# Altium schematic sheet TestPoints.SchDoc
size A
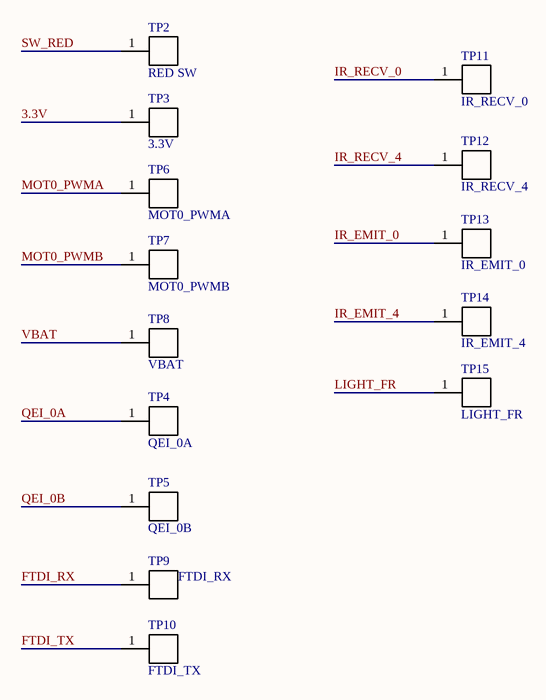
[diagram p0: TestPoints.SchDoc]

## Parts
TP2  RED SW  [TestPoint]
TP3  3.3V  [TestPoint]
TP4  QEI_0A  [TestPoint]
TP5  QEI_0B  [TestPoint]
TP6  MOT0_PWMA  [TestPoint]
TP7  MOT0_PWMB  [TestPoint]
TP8  VBAT  [TestPoint]
TP9  FTDI_RX  [TestPoint]
TP10  FTDI_TX  [TestPoint]
TP11  IR_RECV_0  [TestPoint]
TP12  IR_RECV_4  [TestPoint]
TP13  IR_EMIT_0  [TestPoint]
TP14  IR_EMIT_4  [TestPoint]
TP15  LIGHT_FR  [TestPoint]

## Nets
3.3V: TP3.1
FTDI_RX: TP9.1
FTDI_TX: TP10.1
IR_EMIT_0: TP13.1
IR_EMIT_4: TP14.1
IR_RECV_0: TP11.1
IR_RECV_4: TP12.1
LIGHT_FR: TP15.1
MOT0_PWMA: TP6.1
MOT0_PWMB: TP7.1
QEI_0A: TP4.1
QEI_0B: TP5.1
SW_RED: TP2.1
VBAT: TP8.1

## Library data of the parts
TP2-TP15 = TestPoint